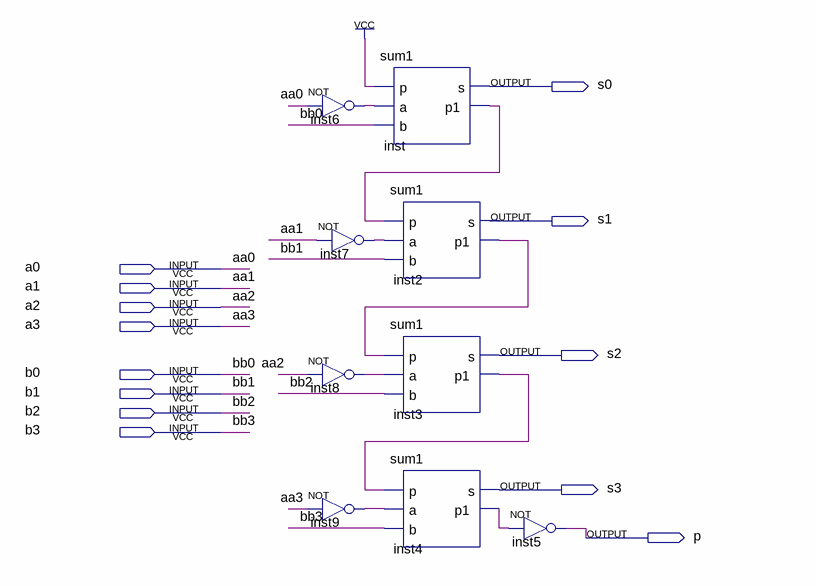
[diagram p0: schematic sheet]
// Quartus schematic vich4.bdf as structural Verilog: 9 symbols, 13 pins
module vich4 (
  input  a0,
  input  a1,
  input  a2,
  input  a3,
  input  b0,
  input  b1,
  input  b2,
  input  b3,
  output s0,
  output s1,
  output s2,
  output s3,
  output p
);

  wire inst2_p1, inst3_p1, inst4_p1, inst6_out, inst7_out, inst8_out, inst9_out, inst_p1;

  not inst6 (inst6_out, a0);
  not inst7 (inst7_out, a1);
  not inst8 (inst8_out, a2);
  not inst9 (inst9_out, a3);
  sum1 inst (.p(1'b1), .a(inst6_out), .b(b0), .s(s0), .p1(inst_p1));
  sum1 inst2 (.p(inst_p1), .a(inst7_out), .b(b1), .s(s1), .p1(inst2_p1));
  sum1 inst3 (.p(inst2_p1), .a(inst8_out), .b(b2), .s(s2), .p1(inst3_p1));
  sum1 inst4 (.p(inst3_p1), .a(inst9_out), .b(b3), .s(s3), .p1(inst4_p1));
  not inst5 (p, inst4_p1);

  // Other names for the same wires on the sheet: aa0 = a0; aa1 = a1; aa2 = a2; aa3 = a3; bb0 = b0; bb1 = b1; bb2 = b2;
  //   bb3 = b3
endmodule
